# Altium schematic sheet [01]-COVER_PAGE.SchDoc
size A4
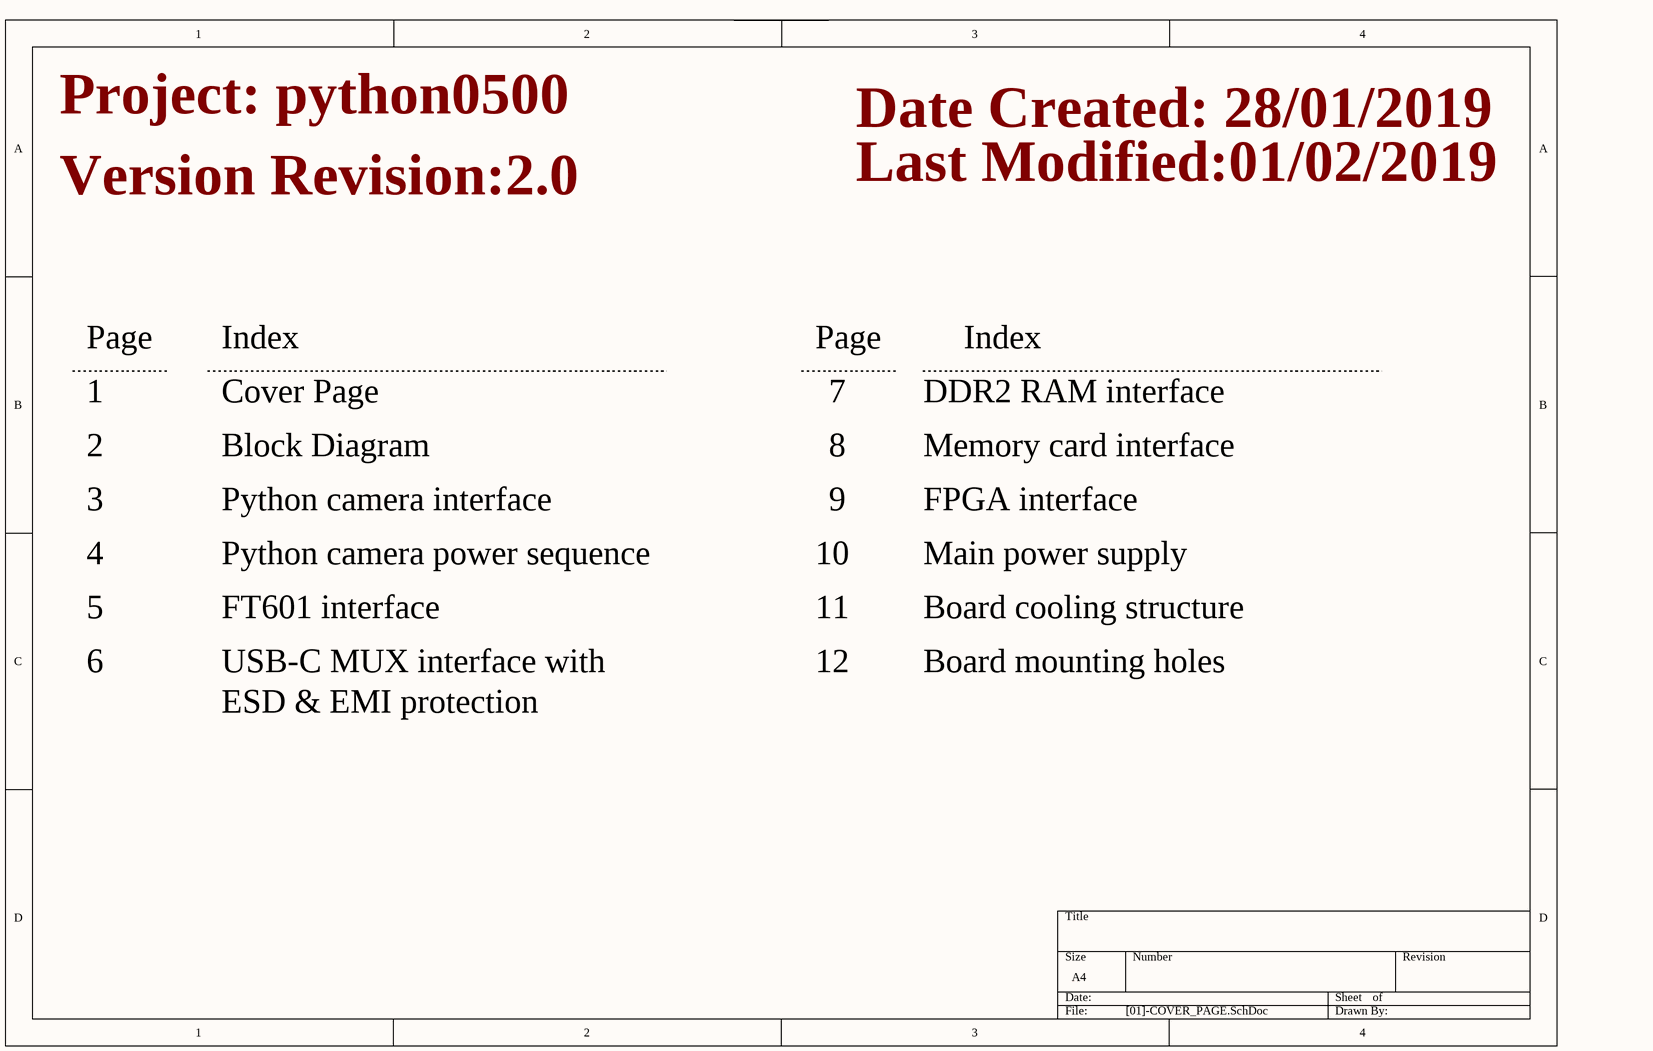
[diagram p0: [01]-COVER_PAGE.SchDoc]

## Notes on the sheet
- Project: python0500
- Date Created: 28/01/2019
- Last Modified:01/02/2019
- Version Revision:2.0
- Page
- Index
- 1
- 2
- Cover Page
- Block Diagram
- 7
- 8
- DDR2 RAM interface
- Memory card interface
- 3
- Python camera interface
- 9
- FPGA interface
- 4
- Python camera power sequence
- 10
- Main power supply
- 5
- FT601 interface
- 11
- Board cooling structure
- 6
- USB-C MUX interface with
- ESD & EMI protection
- 12
- Board mounting holes